# EAGLE design 50mil_5x2_JTAG_to_100mil_1x6_ISP (EAGLE 7.1.0)
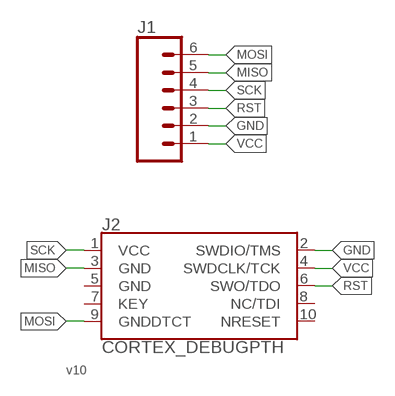
[diagram p0: schematic, sheet 1]

## Parts
J1  CONN_06LONGPADS  [1X06_LONGPADS]
J2  CORTEX_DEBUGPTH  [2X5-PTH-1.27MM]

## Nets
GND: J1.2 J2.2(SWDIO/TMS)
MISO: J1.5 J2.3(GND)
MOSI: J1.6 J2.9(GNDDTCT)
RST: J1.3 J2.6(SWO/TDO)
SCK: J1.4 J2.1(VCC)
VCC: J1.1 J2.4(SWDCLK/TCK)
Unconnected: J2.5(GND) J2.7(KEY) J2.8(NC/TDI) J2.10(NRESET)

## Notes on the sheet
- v10

## Library data of the parts
J1 = SparkFun-Connectors:CONN_06: Multi connection point. Often used as Generic Header-pin footprint for 0.1 inch spaced/style header connections On any of the 0.1 inch spaced packages, you can populate with these: Break Away Headers - Straight <https://www.sparkfun.com/products/116> (PRT-00116) Break Away Male Headers - Right Angle <https://www.sparkfun.com/products/553> (PRT-00553) Female Headers <https://www.sparkfun.com/products/115> (PRT-00115) Break Away Headers - Machine Pin <https://www.sparkfun.com/products/117> (PRT-00117) Break Away Female Headers - Swiss Machine Pin <https://www.sparkfun.com/products/743> (PRT-00743) Arduino Stackable Header - 6 Pin <https://www.sparkfun.com/products/9280> (PRT-09280) For SCREWTERMINALS and SPRING TERMINALS visit here: Screw Terimnals on SparkFun.com <https://www.sparkfun.com/search/results?term=Screw+Terminals> (5mm/3.5mm/2.54mm spacing) This device is also useful as a general connection point to wire up your design to another part of your project. Our various solder wires solder well into these plated through hole pads. Hook-Up Wire - Assortment (Stranded, 22 AWG) <https://www.sparkfun.com/products/11375> (PRT-11375) Hook-Up Wire - Assortment (Solid Core, 22 AWG) <https://www.sparkfun.com/products/11367> (PRT-11367) View the entire wire category on our website here <https://www.sparkfun.com/categories/141>
J2 = SparkFun-Connectors:CORTEX_DEBUG: Cortex Debug Connector Datasheet <http://infocenter.arm.com/help/topic/com.arm.doc.faqs/attached/13634/cortex_debug_connectors.pdf>

## Board
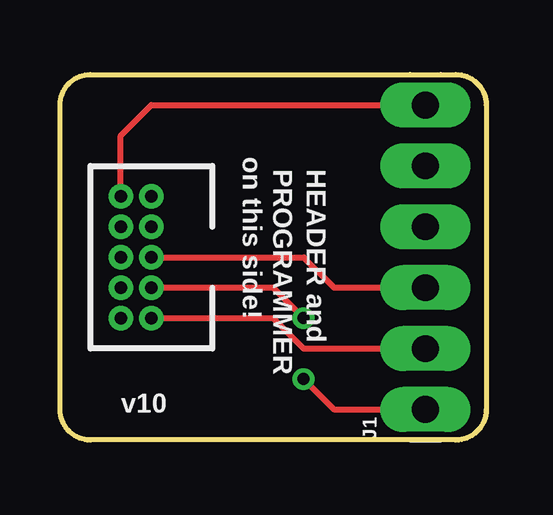
[diagram p1: board, top side]
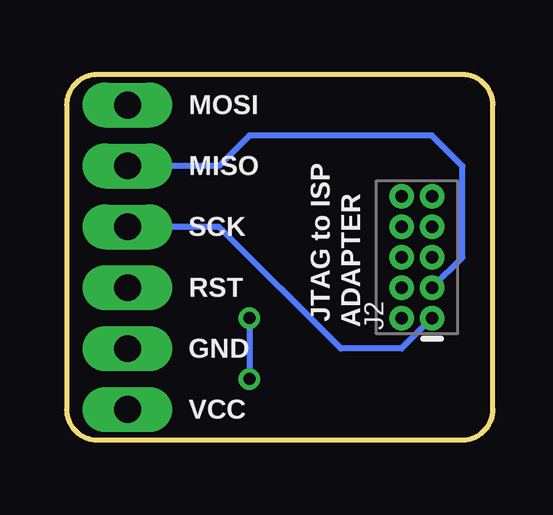
[diagram p2: board, bottom side, seen from below]

Size 17.78 x 15.24 mm. Coordinates in mm from the lower left corner, seen from the top.
Outline: 0,13.97 arc-90 1.27,15.24 16.51,15.24 arc-90 17.78,13.97 17.78,1.27 arc-90 16.51,0 1.27,0 arc-90 0,1.27 0,13.97
Copper layers (1*16): Top 0.035mm / dielectric 1.5mm / Bottom 0.035mm
Design rules "default": minimum track width 10mil, minimum drill 0.6mm, track to track 8mil, track to pad 8mil, pad to pad 8mil, via to via 8mil, smd to smd 8mil, copper to edge 40mil, drill to drill 8mil, minimum pad ring 10mil, minimum via ring 8mil, stop-mask expansion 4mil, vias tented up to drill 0mil, thermal gap 10mil

### Footprints (pad centres in the part's own frame; a part is rotated, then mirrored left to right if it is on the bottom)
1X06_LONGPADS = drill 1.118 pad 1.88 long: 1 0,0; 2 2.54,0; 3 5.08,0; 4 7.62,0; 5 10.16,0; 6 12.7,0
2X5-PTH-1.27MM = drill 0.508 pad 1: 1 -2.54,-0.635; 2 -2.54,0.635; 3 -1.27,-0.635; 4 -1.27,0.635; 5 0,-0.635; 6 0,0.635; 7 1.27,-0.635; 8 1.27,0.635; 9 2.54,-0.635; 10 2.54,0.635

### Placement (x,y rotation side)
J1  15.24,1.27 90 top
J2  3.17,7.62 90 bottom

### Tracks (layer width: path | path; a pad name or v marks a point on that pad's centre or on a via)
GND
  Top 0.254: J2.2 8.89,5.08 10.16,3.81 J1.2
MISO
  Bottom 0.254: J2.3 1.27,7.62 1.27,11.43 2.54,12.7 10.16,12.7 11.43,11.43 J1.5
MOSI
  Top 0.254: J2.9 2.54,12.7 3.81,13.97 J1.6
RST
  Top 0.254: J2.6 10.16,7.62 11.43,6.35 J1.3
SCK
  Bottom 0.254: J1.4 11.43,8.89 6.35,3.81 3.81,3.81 J2.1
VCC  (via drill 0.5)
  Top 0.254: J2.4 8.89,6.35 v10.16,5.08 | v10.16,2.54 11.43,1.27 J1.1
  Bottom 0.254: v10.16,5.08 v10.16,2.54

### Text on the board
tPlace: on this side! | PROGRAMMER | HEADER and | v10
bPlace: MOSI | JTAG to ISP | MISO | ADAPTER | SCK | RST | GND | VCC